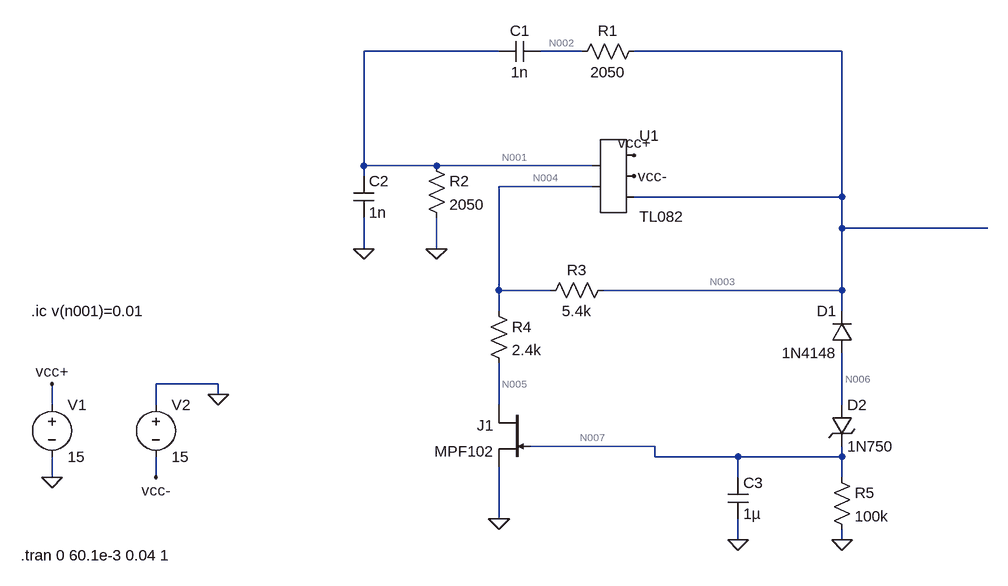
[diagram p0: schematic Circuito.asc]
Circuito.asc, the LTspice schematic file:
Version 4
SHEET 1 1264 1108
WIRE 80 112 -128 112
WIRE 208 112 144 112
WIRE 608 112 288 112
WIRE -128 288 -128 112
WIRE -16 288 -128 288
WIRE 224 288 -16 288
WIRE -128 304 -128 288
WIRE 224 320 80 320
WIRE 608 336 608 112
WIRE 608 336 288 336
WIRE 608 384 608 336
WIRE 832 384 608 384
WIRE -128 416 -128 368
WIRE -16 416 -16 368
WIRE 80 480 80 320
WIRE 160 480 80 480
WIRE 608 480 608 384
WIRE 608 480 240 480
WIRE 80 512 80 480
WIRE 608 512 608 480
WIRE -352 624 -448 624
WIRE -352 640 -352 624
WIRE -608 656 -608 624
WIRE -448 656 -448 624
WIRE 80 656 80 592
WIRE 608 656 608 576
WIRE 320 720 128 720
WIRE 320 736 320 720
WIRE 448 736 320 736
WIRE 608 736 608 720
WIRE 608 736 448 736
WIRE -608 768 -608 736
WIRE -448 768 -448 736
WIRE 448 768 448 736
WIRE 608 768 608 736
WIRE 80 832 80 752
WIRE 448 864 448 832
WIRE 608 864 608 848
FLAG 448 864 0
FLAG 608 864 0
FLAG -608 768 0
FLAG -352 640 0
FLAG -608 624 vcc+
FLAG -448 768 vcc-
FLAG 80 832 0
FLAG -128 416 0
FLAG -16 416 0
FLAG 288 272 vcc+
FLAG 288 304 vcc-
SYMBOL res 304 96 R90
WINDOW 0 0 56 VBottom 2
WINDOW 3 32 56 VTop 2
SYMATTR InstName R1
SYMATTR Value 2050
SYMBOL cap 144 96 R90
WINDOW 0 0 32 VBottom 2
WINDOW 3 32 32 VTop 2
SYMATTR InstName C1
SYMATTR Value 1n
SYMATTR SpiceLine V=0
SYMBOL cap -144 304 R0
SYMATTR InstName C2
SYMATTR Value 1n
SYMBOL res -32 272 R0
SYMATTR InstName R2
SYMATTR Value 2050
SYMBOL res 256 464 R90
WINDOW 0 0 56 VBottom 2
WINDOW 3 32 56 VTop 2
SYMATTR InstName R3
SYMATTR Value 5.4k
SYMBOL diode 624 576 R180
WINDOW 0 24 64 Left 2
WINDOW 3 24 0 Left 2
SYMATTR InstName D1
SYMATTR Value 1N4148
SYMBOL zener 592 656 R0
SYMATTR InstName D2
SYMATTR Value 1N750
SYMBOL res 592 752 R0
SYMATTR InstName R5
SYMATTR Value 100k
SYMBOL cap 432 768 R0
SYMATTR InstName C3
SYMATTR Value 1µ
SYMBOL voltage -608 640 R0
WINDOW 123 0 0 Left 2
WINDOW 39 0 0 Left 2
SYMATTR InstName V1
SYMATTR Value 15
SYMBOL voltage -448 640 R0
WINDOW 123 0 0 Left 2
WINDOW 39 0 0 Left 2
SYMATTR InstName V2
SYMATTR Value 15
SYMBOL res 64 496 R0
SYMATTR InstName R4
SYMATTR Value 2.4k
SYMBOL njf 128 656 M0
SYMATTR InstName J1
SYMATTR Value MPF102
SYMBOL AutoGenerated\\TL082 256 304 R0
SYMATTR InstName U1
TEXT -656 888 Left 2 !.tran 0 60.1e-3 0.04 1
TEXT -640 512 Left 2 !.ic v(n001)=0.01

The netlist it stands for:
* Circuito.asc
R1 N003 N002 2050
C1 N002 N001 1n V=0
C2 N001 0 1n
R2 N001 0 2050
R3 N003 N004 5.4k
D1 N006 N003 1N4148
D2 N006 N007 1N750
R5 N007 0 100k
C3 N007 0 1µ
V1 vcc+ 0 15
V2 0 vcc- 15
R4 N004 N005 2.4k
J1 N005 N007 0 MPF102
* U1: TL082 (symbol AutoGenerated\TL082 not available, pins judged from their places): pin1=N001 pin2=N004 pin3=vcc+ pin4=vcc- pin5=N003
.model D D
.lib standard.dio
.model NJF NJF
.model PJF PJF
.lib standard.jft
.tran 0 60.1e-3 0.04 1
.ic v(n001)=0.01
.backanno
.end

* Results of the author's LTspice run, read from the files saved beside the schematic
* Operating Point, zero values left out:
*   V(n003) = 31.27 mV
*   V(n002) = 31.27 mV
*   V(n001) = 10 mV
*   V(n004) = 10.01 mV
*   V(n006) = 12.64 mV
*   V(n007) = 84.94 µV
*   V(vcc+) = 15 V
*   V(vcc-) = -15 V
*   V(n005) = 562.9 µV
*   I(D2) = 849.4 pA
*   I(D1) = -849.4 pA
*   Id(J1) = 3.937 µA
*   Is(J1) = -3.937 µA
*   I(R4) = 3.937 µA
*   I(R5) = 849.4 pA
*   I(R3) = 3.937 µA
*   I(R2) = 4.878 µA
*   I(V2) = -14.19 mA
*   I(V1) = -14.19 mA
*   Ix(u1:1) = 45.06 pA
*   Ix(u1:2) = 45.06 pA
*   Ix(u1:3) = 14.19 mA
*   Ix(u1:4) = -14.19 mA
*   Ix(u1:5) = -3.937 µA